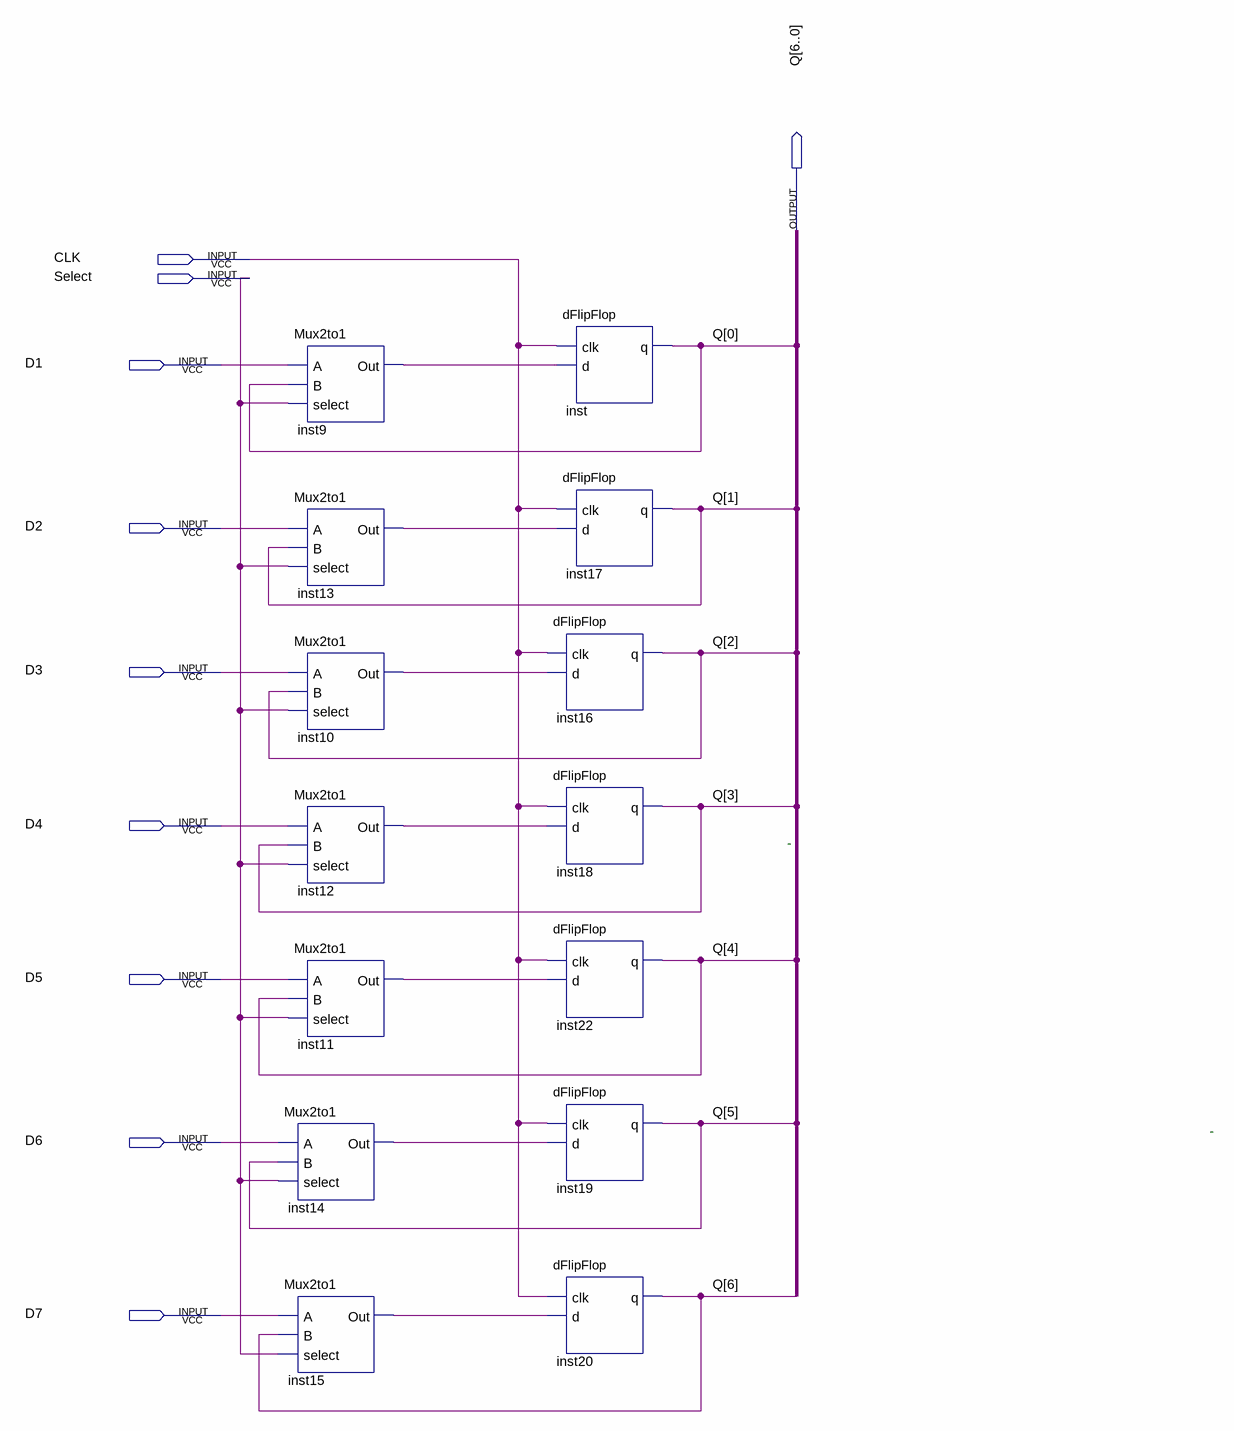
[diagram p0: schematic sheet]
// Quartus schematic Memory-System-Block-Diagram.bdf as structural Verilog: 14 symbols, 10 pins
module \Memory-System-Block-Diagram  (
  input  CLK,
  input  Select,
  input  D1,
  input  D2,
  input  D3,
  input  D4,
  input  D5,
  input  D6,
  input  D7,
  output [6:0] Q
);

  wire inst9_out, inst10_out, inst11_out, inst12_out, inst13_out, inst14_out, inst15_out;

  Mux2to1 inst9 (.A(D1), .B(Q[0]), .select(Select), .Out(inst9_out));
  Mux2to1 inst13 (.A(D2), .B(Q[1]), .select(Select), .Out(inst13_out));
  Mux2to1 inst10 (.A(D3), .B(Q[2]), .select(Select), .Out(inst10_out));
  Mux2to1 inst12 (.A(D4), .B(Q[3]), .select(Select), .Out(inst12_out));
  Mux2to1 inst11 (.A(D5), .B(Q[4]), .select(Select), .Out(inst11_out));
  Mux2to1 inst14 (.A(D6), .B(Q[5]), .select(Select), .Out(inst14_out));
  Mux2to1 inst15 (.A(D7), .B(Q[6]), .select(Select), .Out(inst15_out));
  dFlipFlop inst (.clk(CLK), .d(inst9_out), .q(Q[0]));
  dFlipFlop inst17 (.clk(CLK), .d(inst13_out), .q(Q[1]));
  dFlipFlop inst16 (.clk(CLK), .d(inst10_out), .q(Q[2]));
  dFlipFlop inst18 (.clk(CLK), .d(inst12_out), .q(Q[3]));
  dFlipFlop inst22 (.clk(CLK), .d(inst11_out), .q(Q[4]));
  dFlipFlop inst19 (.clk(CLK), .d(inst14_out), .q(Q[5]));
  dFlipFlop inst20 (.clk(CLK), .d(inst15_out), .q(Q[6]));

  // Notes on the sheet:
  //   -
  //   -
endmodule
